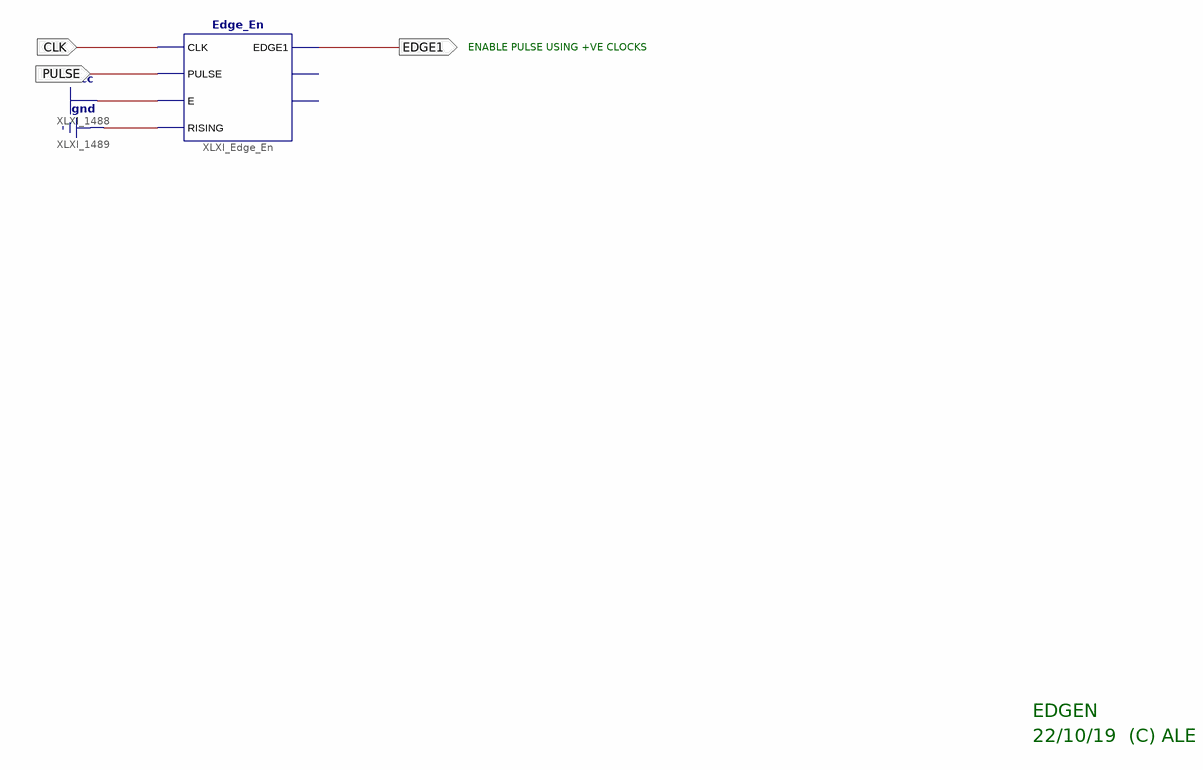
[diagram p0: schematic sheet 1]
// Xilinx ISE schematic EdgeN.sch (spartan3e) as structural Verilog: 1 symbols, 3 ports
module EdgeN (
  input  PULSE,
  input  CLK,
  output EDGE1
);

  Edge_En XLXI_Edge_En (.CLK(CLK), .E(1'b1), .EDGE1(EDGE1), .PULSE(PULSE), .RISING(1'b0));  // open: EDGE0, EDGEQUICK

  // Notes on the sheet:
  //   ENABLE PULSE USING +VE CLOCKS
  //   EDGEN
  //   22/10/19  (C) ALE
endmodule
